# Altium schematic sheet 5_P4_metal_detect.schdoc
size 307 x 218 mm; Symbol: Sheet-Symbol_A4; Device: Sheet-Symbol_A4; @Project Name: modular_design; @Page Count: 5; @Update Date: 2026-07-01; @Create Date: 2026-07-01; @Schematic Name: Schematic1; @Page No: 4; @Page Name: P4_metal_detect; @Board Name: Board1; Company: 嘉立创EDA; Version: V1.0; Page Size: A4; Convert to PCB: yes; Add into BOM: yes; Title Block Position: 3; Width: 1170; Height: 825; Region Start: 1; X Region Count: 6; Y Region Count: 4; Blade Width: 10; @Create Time: 03:19:21; @Update Time: 15:32:19
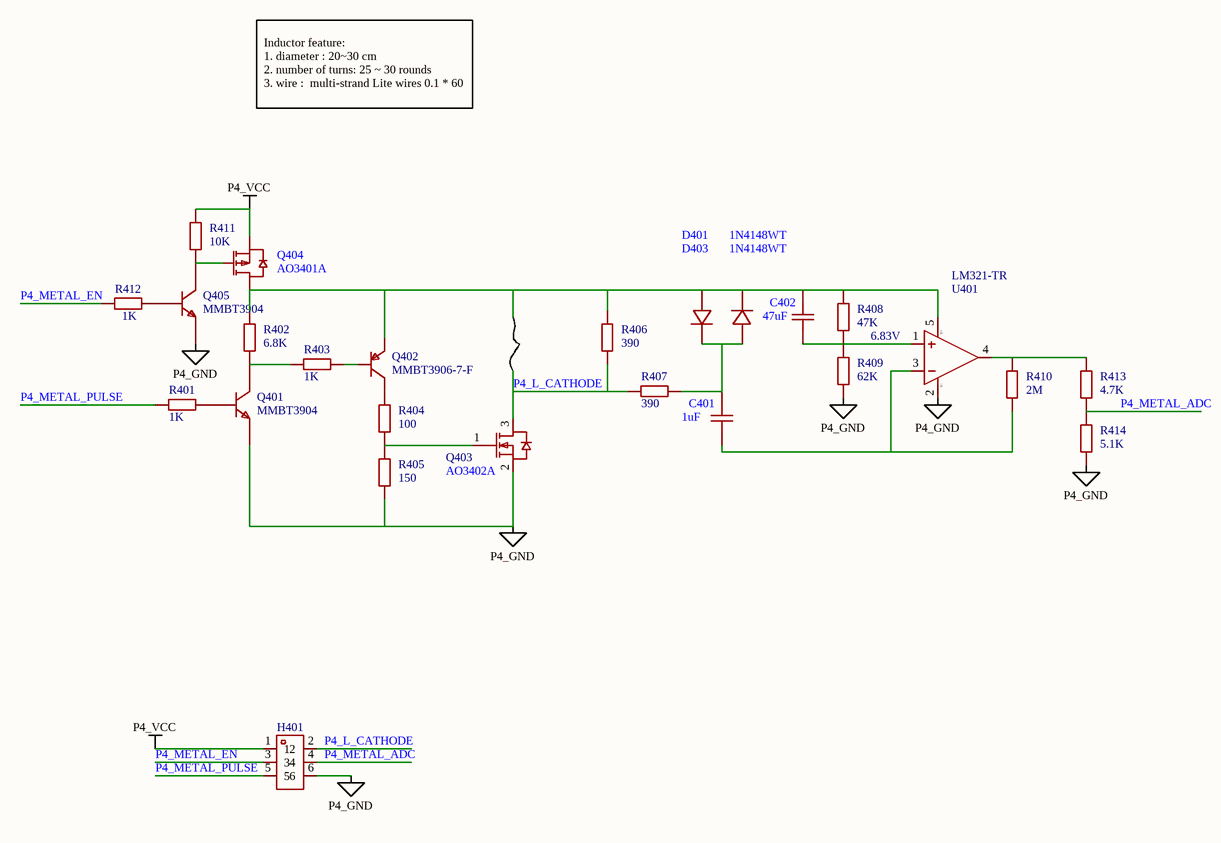
[diagram p0: 5_P4_metal_detect.schdoc]

## Parts
C401  1uF  [C0603]
C402  47uF  [C0805]
D401  1N4148WT  [SOD-523_L1.2-W0.8-LS1.6-RD]
D403  1N4148WT  [SOD-523_L1.2-W0.8-LS1.6-RD]
H401  PZ254V-12-6P  [Finger_2*3]  (value not drawn)
Q401  MMBT3904  [SOT-23-3_L2.9-W1.3-P1.90-LS2.4-BR]
Q402  MMBT3906-7-F  [SOT-23-3_L2.9-W1.6-P1.90-LS2.8-BR]
Q403  AO3402A  [SOT-23-3_L2.9-W1.3-P1.90-LS2.4-BR]
Q404  AO3401A  [SOT-23_L2.9-W1.3-P1.90-LS2.4-BR]
Q405  MMBT3904  [SOT-23-3_L2.9-W1.3-P1.90-LS2.4-BR]
R401  1K  [R0603]
R402  6.8K  [R0603]
R403  1K  [R0603]
R404  100  [R0603]
R405  150  [R0603]
R406  390  [R0603]
R407  390  [R0603]
R408  47K  [R0603]
R409  62K  [R0603]
R410  2M  [R0603]
R411  10K  [R0603]
R412  1K  [R0603]
R413  4.7K  [R0603]
R414  5.1K  [R0603]
U401  LM321-TR  [SOT-23-5_L3.0-W1.7-P0.95-LS2.8-BR]

## Nets
P4_GND: H401.6 Q401.2(E) Q403.2(S) Q405.2(E) R405.1 R409.2 R414.1 U401.2(V-)
P4_VCC: H401.1 Q404.2(S) R411.1
P4_L_CATHODE: H401.2 Q403.3(D) R406.1 R407.2
P4_METAL_ADC: H401.4 R413.1 R414.2
P4_METAL_EN: H401.3 R412.1
P4_METAL_PULSE: H401.5 R401.1
NetC401_1: C401.1 R410.2 U401.3(-IN)
NetC401_2: C401.2 D401.1(C) D403.2(A) R407.1
NetC402_1: C402.1 R408.2 R409.1 U401.1(+IN)
NetC402_2: C402.2 D401.2(A) D403.1(C) Q402.2(E) Q404.3(D) R402.2 R406.2 R408.1 U401.5(V+)
NetQ401_1: Q401.1(B) R401.2
NetQ401_3: Q401.3(C) R402.1 R403.1
NetQ402_1: Q402.1(B) R403.2
NetQ402_3: Q402.3(C) R404.2
NetQ403_1: Q403.1(G) R404.1 R405.2
NetQ404_1: Q404.1(G) Q405.3(C) R411.2
NetQ405_1: Q405.1(B) R412.2
NetR410_1: R410.1 R413.2 U401.4(OUT)

## Notes on the sheet
- Inductor feature:
  1. diameter : 20~30 cm
  2. number of turns: 25 ~ 30 rounds
  3. wire :  multi-strand Lite wires 0.1 * 60
- 6.83V
- 1
- 2
- 3
- 4
- 5
- 6
- A
- B
- C
- 原理图
- Schematic1
- 创建日期
- 更新日期
- 2026-07-01
- 绘制
- 板子
- Board1
- 图页
- P4_metal_detect
- D
- 审阅
- 版本
- 尺寸
- modular_design
- 页
- 共
- V1.0
- A4
- 嘉立创EDA

## Library data of the parts
C401 = CC0805ZKY5V7BB106: Manufacturer: YAGEO(国巨); Symbol: CapAcitance; Add into BOM: yes; Temperature Coefficient: Y5V; Tolerance: -20%~+80%; Voltage Rated: 16V; Device: CC0805ZKY5V7BB106; LCSC Part Name: 10uF -20%~+80% 16V; Manufacturer Part: CC0805ZKY5V7BB106; Supplier Footprint: 0805; JLCPCB Part Class: Extended Part; Datasheet: https://atta.szlcsc.com/upload/public/pdf/source/20170523/1495533897565.pdf; Supplier: LCSC; Convert to PCB: yes; Body Length: -; Body Width: -; Body Thickness: -; Value: 1uF
C402 = CC0805ZKY5V7BB106: Manufacturer: YAGEO(国巨); Symbol: CapAcitance; Add into BOM: yes; Temperature Coefficient: Y5V; Tolerance: -20%~+80%; Voltage Rated: 16V; Value: 1uF; Device: CC0805ZKY5V7BB106; LCSC Part Name: 10uF -20%~+80% 16V; Manufacturer Part: CC0805ZKY5V7BB106; Supplier Footprint: 0805; JLCPCB Part Class: Extended Part; Datasheet: https://atta.szlcsc.com/upload/public/pdf/source/20170523/1495533897565.pdf; Supplier: LCSC; Convert to PCB: yes; Body Length: -; Body Width: -; Body Thickness: -
D401 D403 = 1N4148WT: Manufacturer: onsemi(安森美); Symbol: 1N4148WT_C232841; Add into BOM: yes; Diode Configuration: 独立式; Power Dissipation: 200mW; Reverse Voltage (Vr): 75V; Average Rectified Current (Io): 300mA; Forward Voltage (Vf@If): 1V@10mA; Reverse Leakage Current: 5μA@75V; Reverse Recovery Time (trr): 4ns; Device: 1N4148WT; LCSC Part Name: 75V 300mA 4ns; Supplier Part: C232841; Manufacturer Part: 1N4148WT; Supplier Footprint: SOD-523F; JLCPCB Part Class: Extended Part; Datasheet: https://atta.szlcsc.com/upload/public/pdf/source/20181222/C232841_42C5BA49E5A441BB8F6B91D0F4CD0D51.pdf; Supplier: LCSC; Convert to PCB: yes; Operating Temperature: -55℃~+150℃@(Tj)
H401 = PZ254V-12-6P: Manufacturer: XFCN(兴飞); Add into BOM: yes; Pitch: 2.54mm; Pin Structure: 2x3P; Circluar Pins/Square Pins: 方针; Symbol: PZ254V-12-6P; Device: PZ254V-12-6P; LCSC Part Name: 2.54mm 2x3P 直插 方针; Supplier Part: C492420; Manufacturer Part: PZ254V-12-6P; Supplier Footprint: 插件,P=2.54mm; JLCPCB Part Class: Extended Part; Datasheet: https://atta.szlcsc.com/upload/public/pdf/source/20200309/C492420_BAECB307B001054C09D200388220EAE6.pdf; Supplier: LCSC; Convert to PCB: yes; Number of Pins: 6; Number of Rows: 2; Row Spacing: 2.54mm; Mounting Type: 直插; Current Rating (Max): -; Voltage Rating (Max): -; Length of Mating Pin: 6mm; Insulation Height: 2.5mm; Length of End Connection Pin: 3mm; Contact Material: 黄铜; Contact Plating: -; Operating Temperature Range: -40℃~+105℃; Color: 黑色
Q401 Q405 = MMBT3904: Manufacturer: ST(先科); Add into BOM: yes; Transistor Type: NPN; Collector-Emitter Breakdown Voltage (Vceo): 40V; Collector Current (Ic): 200mA; Power Dissipation (Pd): 350mW; Collector Cut-Off Current (Icbo): 50nA; Collector-Emitter Saturation Voltage (VCE(sat)@Ic,Ib): 300mV@50mA,5mA; DC Current Gain (hFE@Ic,Vce): 100@10mA,1V; Transition Frequency (fT): 300MHz; Symbol: MMBT3904; Device: MMBT3904; LCSC Part Name: MMBT3904; Supplier Part: C84104; Manufacturer Part: MMBT3904; Supplier Footprint: SOT-23(SOT-23-3); JLCPCB Part Class: Extended Part; Datasheet: https://atta.szlcsc.com/upload/public/pdf/source/20161024/1477288599731.pdf; Supplier: LCSC; Convert to PCB: yes; Operating Temperature: +150℃@(Tj); Origin Footprint: SOT-23-3_L2.9-W1.3-P1.90-LS2.4-BR
Q402 = MMBT3906-7-F: Manufacturer: DIODES(美台); Add into BOM: yes; Transistor Type: PNP; Collector-Emitter Breakdown Voltage (Vceo): 40V; Collector Current (Ic): 200mA; Power Dissipation (Pd): 300mW; Collector-Emitter Saturation Voltage (VCE(sat)@Ic,Ib): 400mV@50mA,5mA; DC Current Gain (hFE@Ic,Vce): 100@10mA,1V; Transition Frequency (fT): 250MHz; Symbol: MMBT3906-7-F; Device: MMBT3906-7-F; LCSC Part Name: MMBT3906-7-F; Supplier Part: C82762; Manufacturer Part: MMBT3906-7-F; Supplier Footprint: SOT-23(SOT-23-3); JLCPCB Part Class: Extended Part; Datasheet: https://atta.szlcsc.com/upload/public/pdf/source/20171221/C82762_15138313065711195601.pdf; Supplier: LCSC; Convert to PCB: yes; Collector Cut-Off Current (Icbo): -; Operating Temperature: -55℃~+150℃@(Tj); Origin Footprint: SOT-23-3_L2.9-W1.6-P1.90-LS2.8-BR
Q403 = AO3402A: Manufacturer: UMW(友台半导体); Add into BOM: yes; Symbol: AO3402A; Device: AO3402A; LCSC Part Name: AO3402A; Supplier Part: C347477; Manufacturer Part: AO3402A; Supplier Footprint: SOT-23; JLCPCB Part Class: Extended Part; Datasheet: https://atta.szlcsc.com/upload/public/pdf/source/20190109/C347477_203244A660E0B7D1849BF8F36C695C58.pdf; Supplier: LCSC; Convert to PCB: yes
Q404 = AO3401A_C347476: Manufacturer: UMW(友台半导体); Add into BOM: yes; Symbol: AO3401A_C347476; Device: AO3401A_C347476; LCSC Part Name: AO3401A; Supplier Part: C347476; Manufacturer Part: AO3401A; Supplier Footprint: SOT-23; JLCPCB Part Class: Extended Part; Datasheet: https://atta.szlcsc.com/upload/public/pdf/source/20190827/C347476_6CCC01FEC3E3D166C83BA0E415FD2056.pdf; Supplier: LCSC; Convert to PCB: yes
R401-R410 R412-R414 = Res_0603: Convert to PCB: yes; Value: 10K; Symbol: Res_0603; Device: Res_0603; Add into BOM: yes; Supplier Footprint: 0603; Origin Footprint: R0603
R411 = Res_0603: Convert to PCB: yes; Symbol: Res_0603; Device: Res_0603; Add into BOM: yes; Supplier Footprint: 0603; Value: 10K; Origin Footprint: R0603
U401 = LM321-TR_C97688: Manufacturer: 3PEAK; Add into BOM: yes; Amplifier Type: General Purpose; Number of Circuits: 1; Gain Bandwidth Product（GBP）: 1.2MHz; Slew Rate（SR）: 0.55 V/us; Supply Voltage（Single）: 3V ~ 36V, ±1.5V ~ 18V; Iq per channel (Typ): 200μA; Symbol: LM321-TR_C97688; Device: LM321-TR_C97688; LCSC Part Name: LM321-TR; Supplier Part: C97688; Manufacturer Part: LM321-TR; Supplier Footprint: SOT-23-5; JLCPCB Part Class: Extended Part; Datasheet: https://atta.szlcsc.com/upload/public/pdf/source/20170322/1490151696478.pdf; Supplier: LCSC; Convert to PCB: yes; Origin Footprint: SOT-23-5_L3.0-W1.7-P0.95-LS2.8-BR